# EAGLE design ps2 (EAGLE 7.2.0)
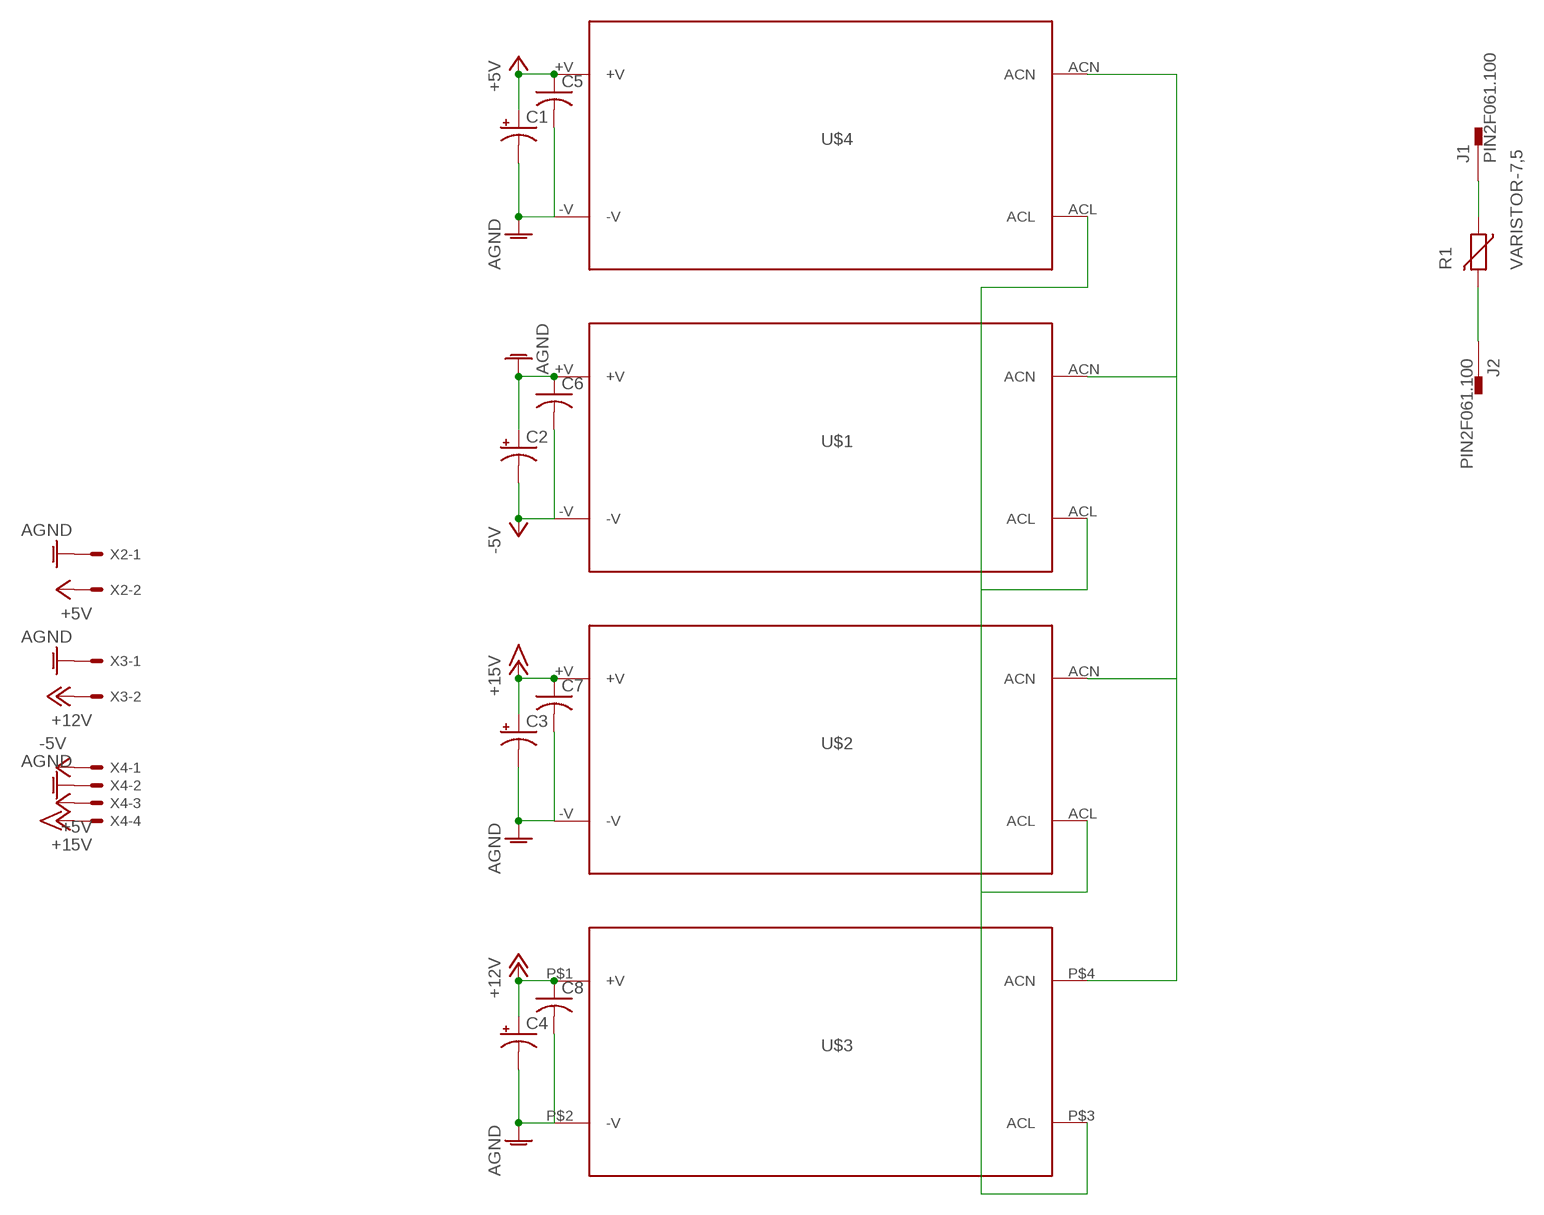
[diagram p0: schematic, sheet 1]

## Parts
C1  CPOL-USE10-22.5  [EB22,5D]
C2  CPOL-USE10-22.5  [EB22,5D]
C3  CPOL-USE10-22.5  [EB22,5D]
C4  CPOL-USE10-22.5  [EB22,5D]
C5  C-US075-052X106  [C075-052X106]
C6  C-US075-052X106  [C075-052X106]
C7  C-US075-052X106  [C075-052X106]
C8  C-US075-052X106  [C075-052X106]
J1  PIN2F061.100  [F061.100]
J2  PIN2F061.100  [F061.100]
R1  VARISTOR-7,5  [R-7,5]
U$1  IRM-30-5  [IRM-30-15]
U$2  IRM-30-15  [IRM-30-15]
U$3  IRM-60-12  [IRM-60-12]
U$4  IRM-30-5  [IRM-30-15]
X2  KK-156-2  [KK-156-2]
X3  KK-156-2  [KK-156-2]
X4  KK-156-4  [KK-156-4]

## Nets
+5V: C1.+ C5.1 U$4.+V X2.2 X4.3
+12V: C4.+ C8.1 U$3.P$1(+V) X3.2
+15V: C3.+ C7.1 U$2.+V X4.4
-5V: C2.- C6.2 U$1.-V X4.1
ACL: J1.A1 J1.A2 R1.1 U$1.ACL U$2.ACL U$3.P$3(ACL) U$4.ACL
ACN: J2.A1 J2.A2 R1.2 U$1.ACN U$2.ACN U$3.P$4(ACN) U$4.ACN
AGND: C1.- C2.+ C3.- C4.- C5.2 C6.1 C7.2 C8.2 U$1.+V U$2.-V U$3.P$2(-V) U$4.-V X2.1 X3.1 X4.2

## Library data of the parts
C1-C4 = rcl:CPOL-US: POLARIZED CAPACITOR, American symbol
C5-C8 = resistor:C-US: CAPACITOR, American symbol
J1 J2 = con-faston:PIN2: Flachstecker Typ Tyco/Electronics/AMP TAB, FASTON Printed Circuit Board Tabs Source: http://www.buerklin.com, http://catalog.tycoelectronics.com; OC_FARNELL: unknown; OC_NEWARK: unknown
R1 = varistor:VARISTOR: VARISTOR
U$1 U$4 = meanwell:IRM-30-5
U$2 = meanwell:IRM-30-15
U$3 = meanwell:IRM-60-12
X2 X3 = con-molex:KK-156-2: KK 156 HEADER Source: http://www.molex.com/pdm_docs/sd/026604100_sd.pdf; OC_FARNELL: unknown; OC_NEWARK: unknown
X4 = con-molex:KK-156-4: KK 156 HEADER Source: http://www.molex.com/pdm_docs/sd/026604100_sd.pdf; OC_FARNELL: unknown; OC_NEWARK: unknown

## Board
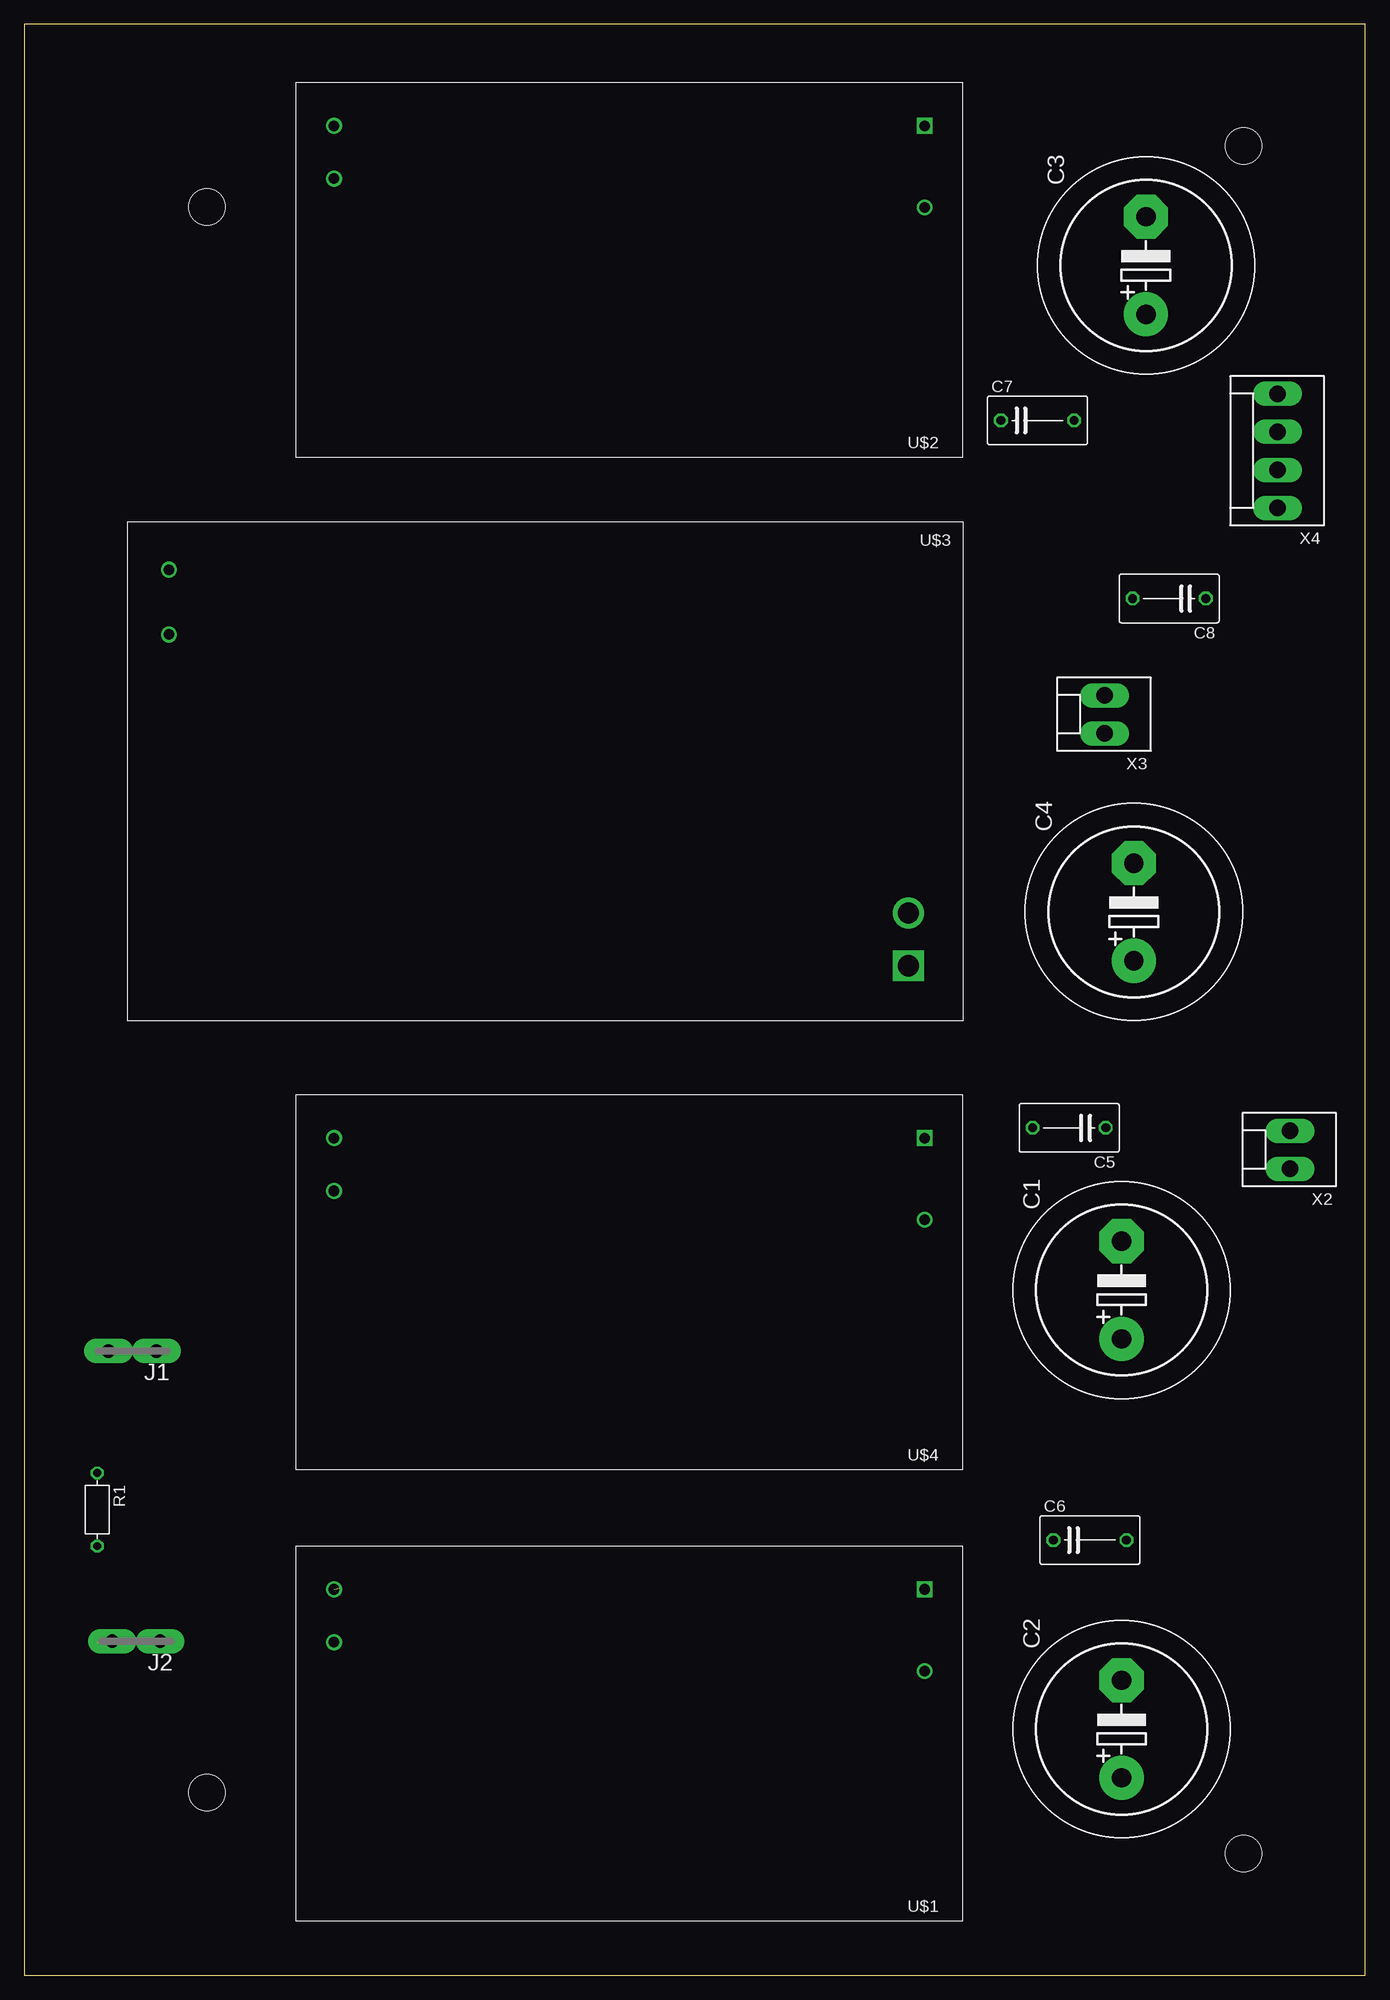
[diagram p1: board, top side]
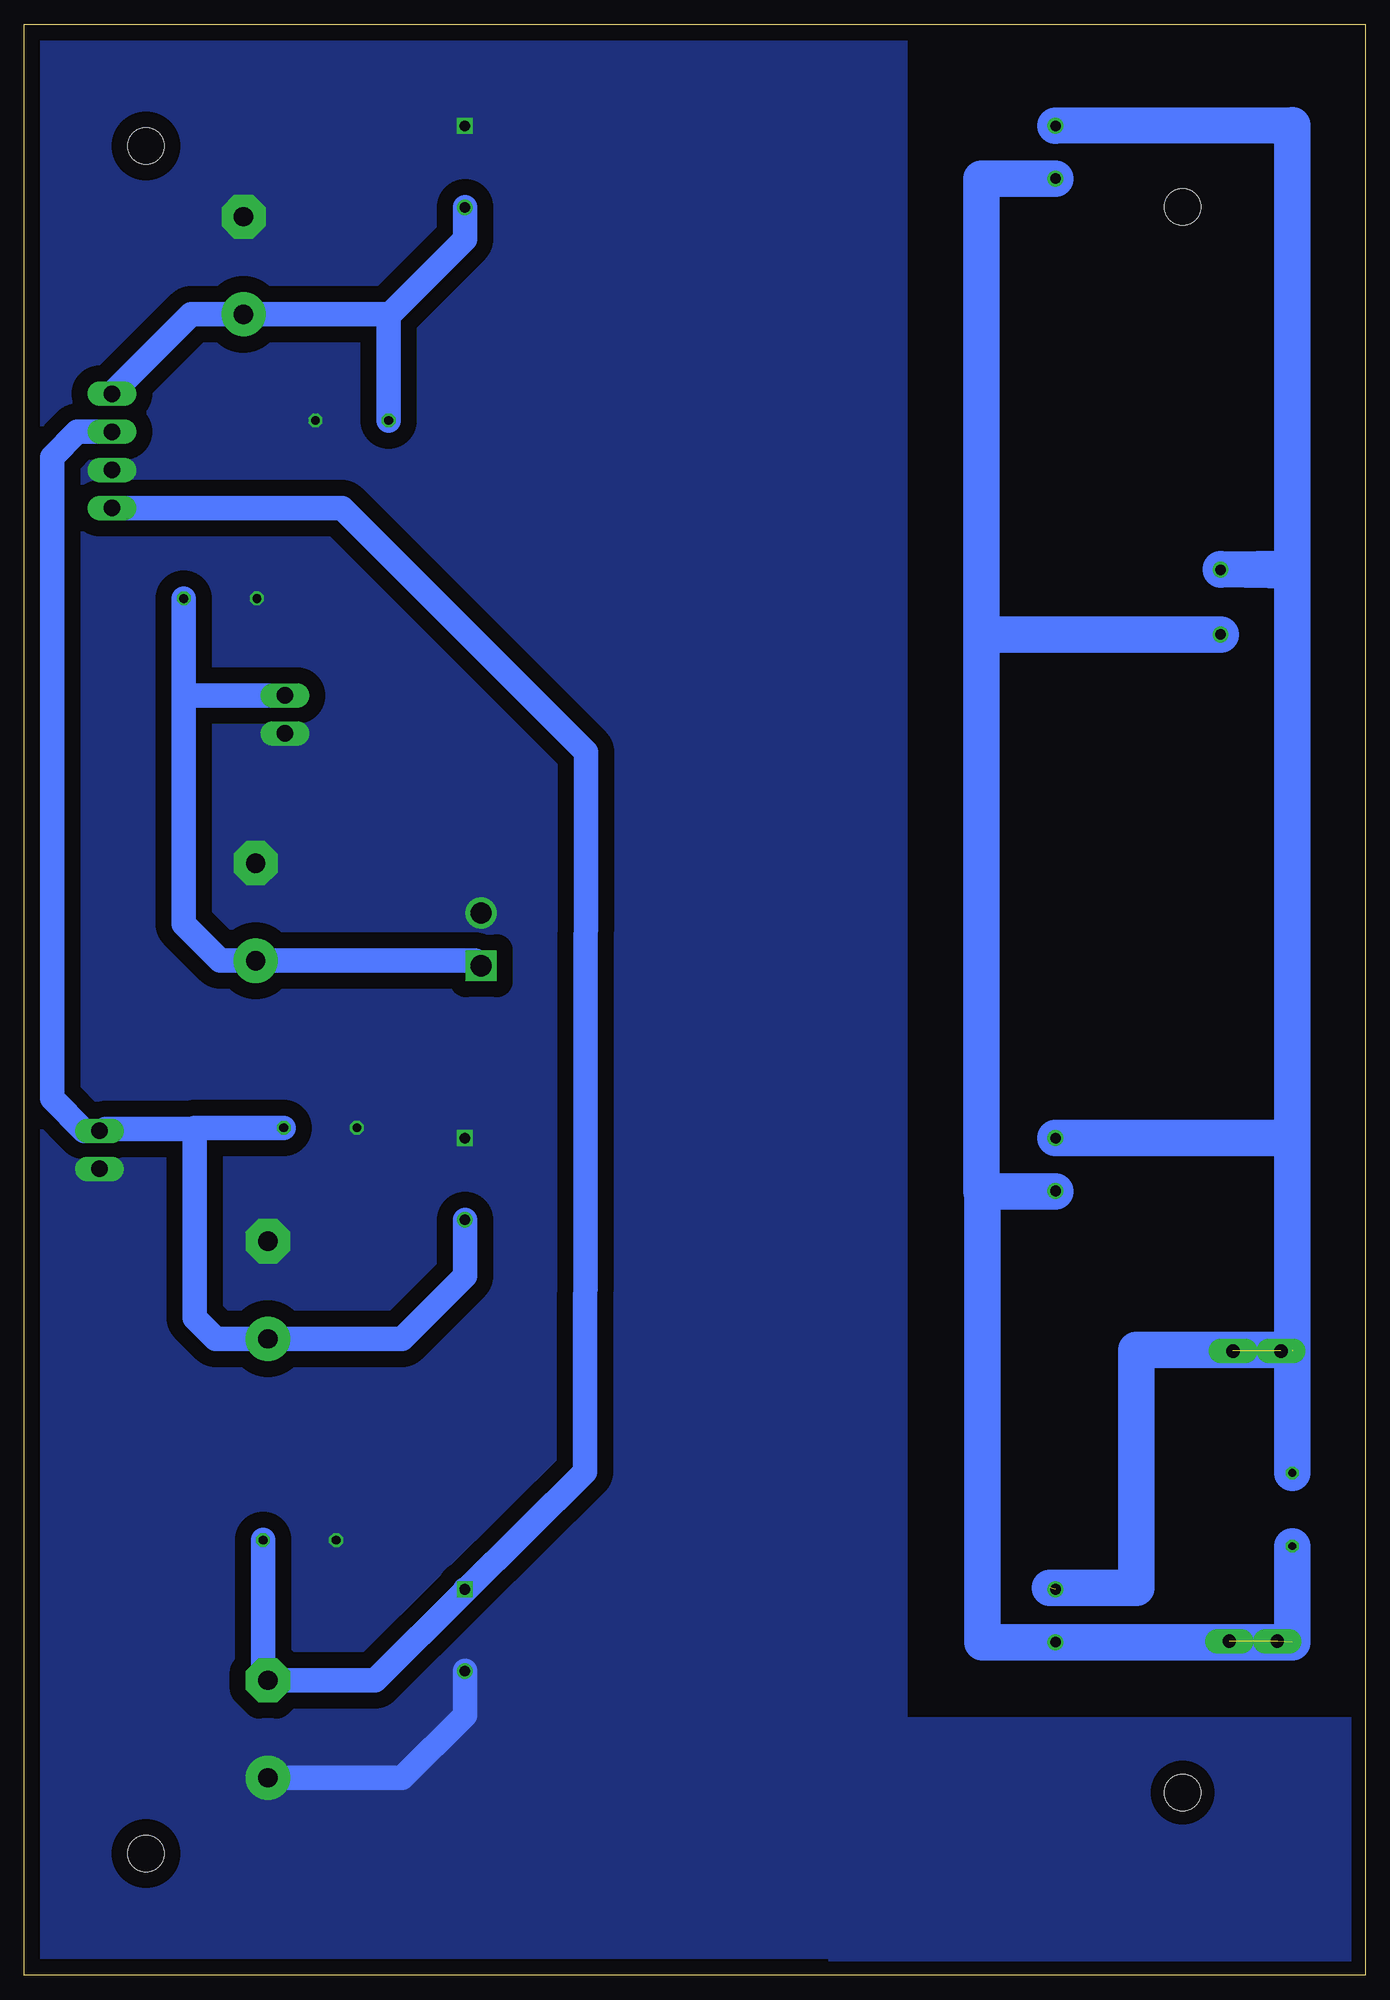
[diagram p2: board, bottom side, seen from below]

Size 139.7 x 203.2 mm. Coordinates in mm from the lower left corner, seen from the top.
Outline: 139.7,203.2 0,203.2 0,0 139.7,0 139.7,203.2
Copper layers (1*16): Top 0.035mm / dielectric 1.5mm / Bottom 0.035mm
Design rules "default": minimum track width 10mil, minimum drill 24mil, track to track 8mil, track to pad 8mil, pad to pad 8mil, via to via 8mil, smd to smd 8mil, copper to edge 40mil, drill to drill 8mil, minimum pad ring 10mil, minimum via ring 8mil, stop-mask expansion 4mil, vias tented up to drill 0mil, thermal gap 10mil
Holes 3.8 mm at 19.05,184.15 127,190.5 127,12.7 19.05,19.05

### Footprints (pad centres in the part's own frame; a part is rotated, then mirrored left to right if it is on the bottom)
EB22,5D = drill 2.007 pad 4.597: + -5.08,0 | drill 2.007 pad 4.597 octagon: - 5.08,0
C075-052X106 = drill 0.914 octagon: 1 -3.81,0; 2 3.81,0
F061.100 = drill 1.4 pad 2.54 long: A1 -2.5,0; A2 2.5,0
R-7,5 = drill 0.813 octagon: 1 -3.81,0; 2 3.81,0
IRM-30-15 = drill 1.1: +V 4,13; ACL 65.5,4.5; ACN 65.5,10 | drill 1.1 square: -V 4,4.5
IRM-60-12 = drill 2.2 square: P$1 5.7,46.25 | drill 2.2: P$2 5.7,40.75 | drill 1.1: P$3 82.7,5; P$4 82.7,11.75
KK-156-2 = drill 1.7 pad 2.184 long: 1 -1.98,0; 2 1.98,0
KK-156-4 = drill 1.7 pad 2.184 long: 1 -5.94,0; 2 -1.98,0; 3 1.98,0; 4 5.94,0

### Placement (x,y rotation side)
C1  114.3,71.37 90 top
C2  114.3,25.65 90 top
C3  116.84,178.05 90 top
C4  115.57,110.74 90 top
C5  108.84,88.27 180 top
C6  111,45.34 0 top
C7  105.54,161.93 0 top
C8  119.25,143.38 180 top
J1  11.3,65.02 180 top
J2  11.68,34.8 180 top
R1  7.62,48.51 270 top
U$1  97.79,44.7 180 top
U$2  97.79,197.1 180 top
U$3  97.79,151.38 180 top
U$4  97.79,91.69 180 top
X2  131.83,85.98 90 top
X3  112.52,131.32 90 top
X4  130.56,158.75 90 top

### Tracks (layer width: path | path; a pad name or v marks a point on that pad's centre or on a via)
+5V
  Bottom 2.54: U$4.+V 93.79,72.83 100.33,66.29 C1.+ 119.76,66.29 121.92,68.45 121.92,88.27 | 121.92,88.27 121.79,88.14 131.2,88.14 131.33,88.01 X2.2 133.43,87.96 136.78,91.31 136.78,158.12 134.16,160.73 X4.3 | C5.1 121.92,88.27
+12V
  Bottom 2.54: U$3.P$1 92.18,105.13 92.71,105.66 C4.+ | C4.+ 102.62,105.66 | C4.+ 119.25,105.66 123.06,109.47 123.06,133.3 | 123.06,133.3 123.06,133.35 | X3.2 119.05,133.3 | 119.05,133.3 123.06,133.35 | C8.1 123.06,133.35 | 123.06,133.3 119.05,133.3
+15V
  Bottom 2.54: U$2.+V 93.79,180.78 101.6,172.97 101.85,172.97 | 101.85,172.97 C3.+ 122.27,172.97 X4.4 | C7.1 101.73,172.85 101.85,172.97
-5V
  Bottom 2.54: U$1.-V 93.79,40.07 | 93.79,40.07 103.12,30.73 C2.- 114.81,31.24 C6.2 | X4.1 106.58,152.81 81.15,127.38 81.28,52.45 93.79,40.07
ACL  (3 unrouted)
  Bottom 2.54: U$3.P$3 15.09,146.43 | U$4.ACL 32.29,87.12 7.62,87.12 | 7.62,65.02 J1.A2
  Bottom 3.81: U$2.ACL 7.62,192.66 7.62,146.51 | 7.62,146.51 7.62,146.3 | 7.62,146.51 U$3.P$3 | 15.09,146.43 7.62,146.3 | 7.62,146.3 7.62,87.19 | 7.62,87.19 7.62,87.12 7.62,65.15 23.88,65.15 23.88,40.39 32.89,40.39 | 7.62,87.19 U$4.ACL | R1.1 7.62,65.02
ACN  (2 unrouted)
  Bottom 2.54: U$2.ACN 32.29,187.07 | U$4.ACN 32.29,81.66 | 39.88,81.66 40.01,81.66 | U$1.ACN 32.29,34.67
  Bottom 3.81: 32.29,187.07 40.01,187.07 40.01,139.63 | 40.01,139.63 U$3.P$4 | 40.01,81.66 40.01,139.63 | 32.29,81.66 39.88,81.66 39.88,34.7 U$1.ACN | 32.29,34.67 7.62,34.67 R1.2
AGND
  Bottom 2.54: U$1.+V 93.79,27.11 100.33,20.57 C2.+
  pour Bottom (isolate 1.676, no thermals): 47.88,202.82 139.83,202.82 139.83,-0.25 47.88,-0.25
N$1
  pour Bottom (isolate 1.422, no thermals): 0,26.67 55.75,26.67 55.75,-0.25 0,-0.25